# EAGLE schematic WorkingPlaftorm (EAGLE 9.6.2)
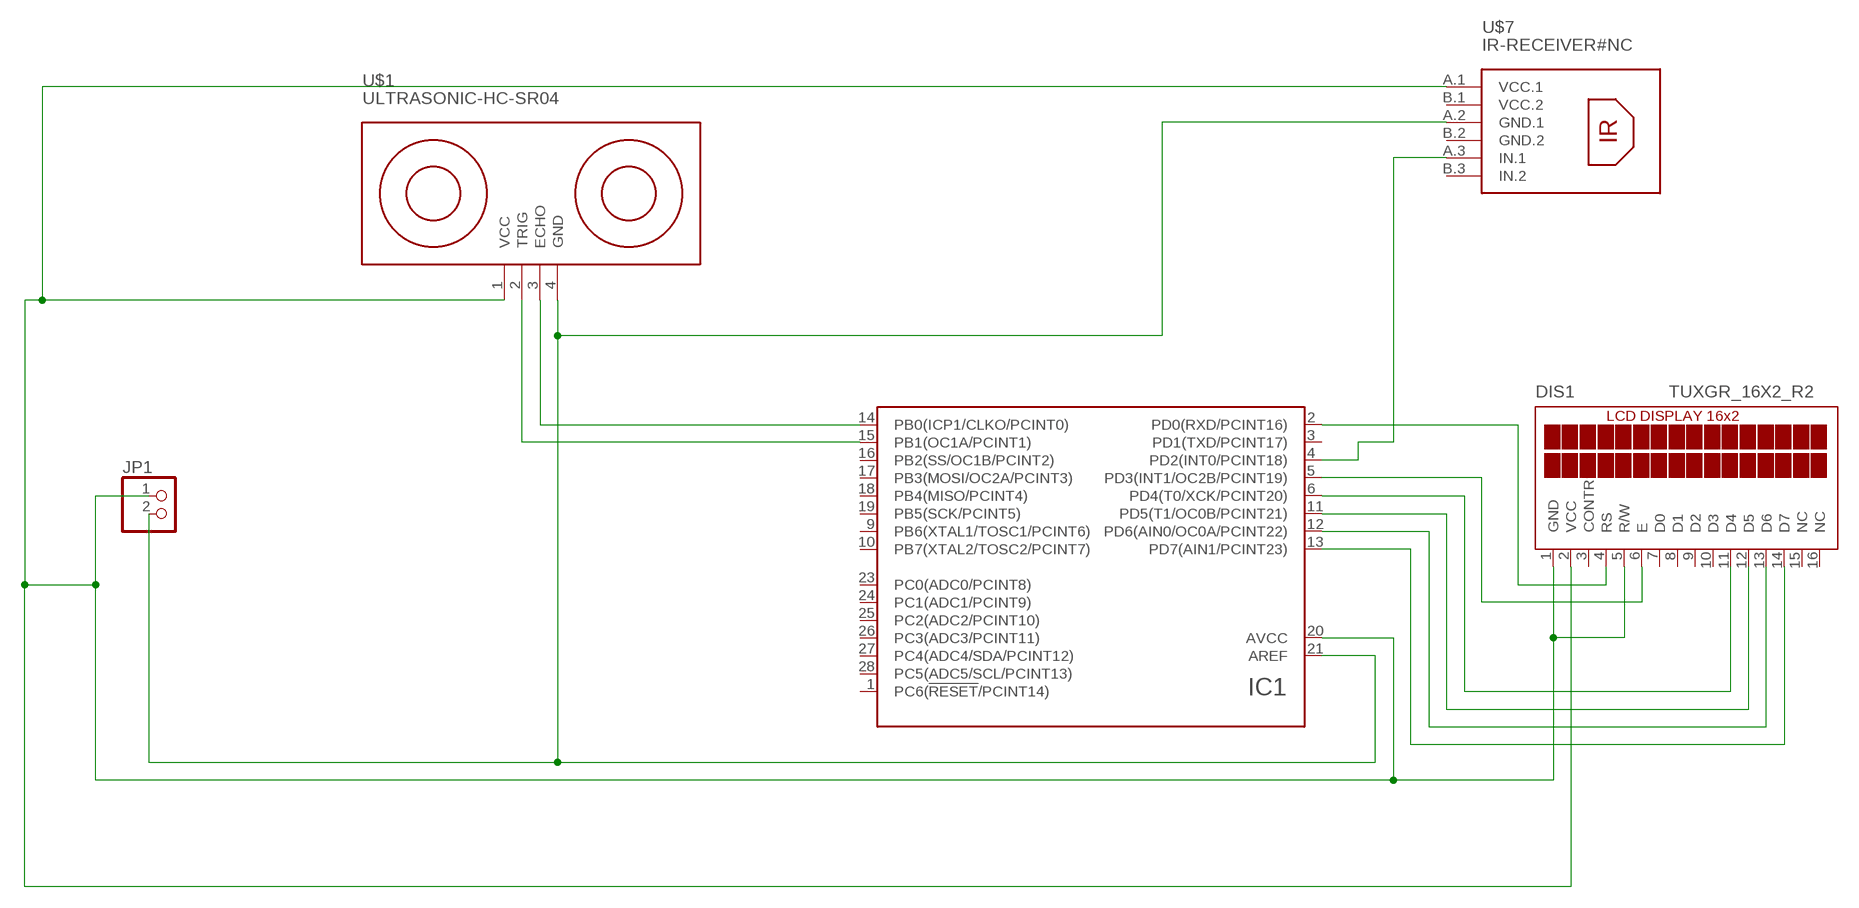
[diagram p0: schematic, sheet 1]

## Parts
DIS1  TUXGR_16X2_R2  [TUXGR_16X2_R2]
IC1  ATMEGA48/88/168/328-PU(DIP28)PU  [DIL28]
JP1  PINHD-1X2  [1X02]
U$1  ULTRASONIC-HC-SR04  [ULTRASONIC-HC-SR04]
U$7  IR-RECEIVER#NC  [IR-RECEIVER#NC]

## Nets
N$1: IC1.15(PB1(OC1A/PCINT1)) U$1.2(TRIG)
N$2: IC1.14(PB0(ICP1/CLKO/PCINT0)) U$1.3(ECHO)
N$3: IC1.4(PD2(INT0/PCINT18)) U$7.A.3(IN.1)
N$4: DIS1.11(D4) IC1.6(PD4(T0/XCK/PCINT20))
N$5: DIS1.12(D5) IC1.11(PD5(T1/OC0B/PCINT21))
N$6: DIS1.13(D6) IC1.12(PD6(AIN0/OC0A/PCINT22))
N$7: DIS1.14(D7) IC1.13(PD7(AIN1/PCINT23))
N$8: DIS1.4(RS) IC1.2(PD0(RXD/PCINT16))
N$9: DIS1.6(E) IC1.5(PD3(INT1/OC2B/PCINT19))
N$10: IC1.21(AREF) JP1.2 U$1.4(GND) U$7.A.2(GND.1)
N$11: DIS1.1(GND) DIS1.2(VCC) DIS1.5(R/W) IC1.20(AVCC) JP1.1 U$1.1(VCC) U$7.A.1(VCC.1)
Unconnected: DIS1.3(CONTR) DIS1.7(D0) DIS1.8(D1) DIS1.9(D2) DIS1.10(D3) DIS1.15(NC) DIS1.16(NC) IC1.1(PC6(!RESET!/PCINT14)) IC1.3(PD1(TXD/PCINT17)) IC1.9(PB6(XTAL1/TOSC1/PCINT6)) IC1.10(PB7(XTAL2/TOSC2/PCINT7)) IC1.16(PB2(SS/OC1B/PCINT2)) IC1.17(PB3(MOSI/OC2A/PCINT3)) IC1.18(PB4(MISO/PCINT4)) IC1.19(PB5(SCK/PCINT5)) IC1.23(PC0(ADC0/PCINT8)) IC1.24(PC1(ADC1/PCINT9)) IC1.25(PC2(ADC2/PCINT10)) IC1.26(PC3(ADC3/PCINT11)) IC1.27(PC4(ADC4/SDA/PCINT12)) IC1.28(PC5(ADC5/SCL/PCINT13)) U$7.B.1(VCC.2) U$7.B.2(GND.2) U$7.B.3(IN.2)

## Power pins joined to a net without a drawn wire
GND: IC1.8(GND) IC1.22(GND)
UCC: IC1.7(UCC)

## Library data of the parts
DIS1 = display-lcd:TUXGR_16X2_R2: Tuxgraphics LCD display 16x2 characters reflective, without background light Source: tuxgr_12x2_r2.pdf; OC_FARNELL: unknown; OC_NEWARK: unknown
IC1 = atmel_tiny24-44-84tiny48-88mega48-88-168-328:ATMEGA48/88/168/328-PU(DIP28)
JP1 = pinhead:PINHD-1X2: PIN HEADER
U$1 = diy-modules:ULTRASONIC-HC-SR04: Ultrasonic Ranging Module HC-SR04 More details available here: http://randomnerdtutorials.com/complete-guide-for-ultrasonic-sensor-hc-sr04/ Click here to find device on ebay.com <http://www.ebay.com/sch/hc+sr04+ultrasonic>
U$7 = diy-modules:IR-RECEIVER#NC: IR Receiver Module without IR sensor connector